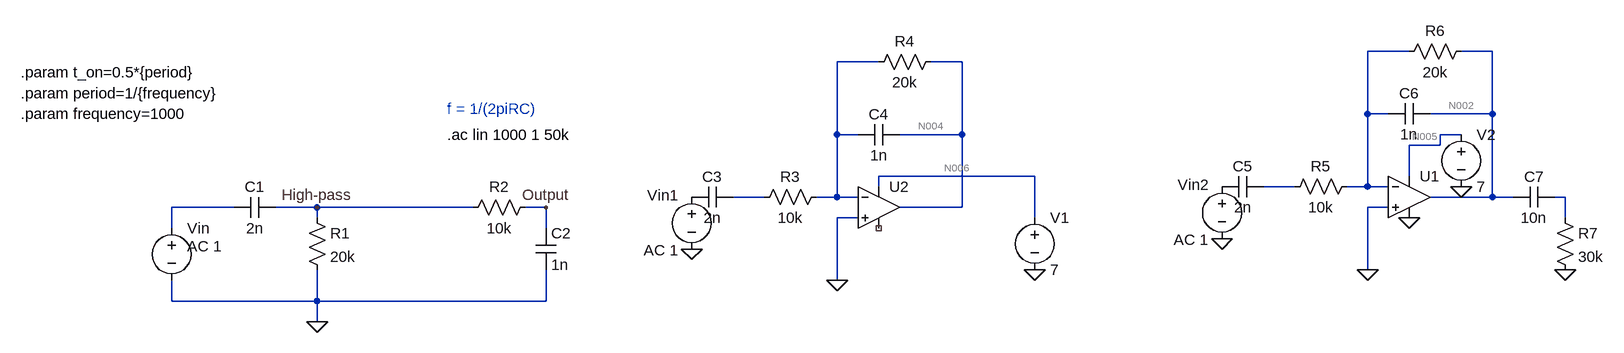
[diagram p0: schematic IR Bandpass Filters.asc]
IR Bandpass Filters.asc, the LTspice schematic file:
Version 4
SHEET 1 2036 680
WIRE 1728 -128 1664 -128
WIRE 1856 -128 1808 -128
WIRE 912 -112 848 -112
WIRE 1040 -112 992 -112
WIRE 1664 -32 1664 -128
WIRE 1696 -32 1664 -32
WIRE 1856 -32 1856 -128
WIRE 1856 -32 1760 -32
WIRE 848 0 848 -112
WIRE 880 0 848 0
WIRE 1040 0 1040 -112
WIRE 1040 0 944 0
WIRE 1808 0 1776 0
WIRE 1776 16 1776 0
WIRE 1776 16 1728 16
WIRE 1152 64 912 64
WIRE 1728 64 1728 16
WIRE 912 80 912 64
WIRE 1552 80 1504 80
WIRE 1664 80 1664 -32
WIRE 1664 80 1632 80
WIRE 1696 80 1664 80
WIRE 736 96 688 96
WIRE 848 96 848 0
WIRE 848 96 816 96
WIRE 880 96 848 96
WIRE 1856 96 1856 -32
WIRE 1856 96 1760 96
WIRE 1888 96 1856 96
WIRE 1968 96 1952 96
WIRE -80 112 -176 112
WIRE 48 112 -16 112
WIRE 288 112 48 112
WIRE 400 112 368 112
WIRE 1040 112 1040 0
WIRE 1040 112 944 112
WIRE 1696 112 1664 112
WIRE 48 128 48 112
WIRE 880 128 848 128
WIRE 1152 128 1152 64
WIRE 1968 128 1968 96
WIRE -176 144 -176 112
WIRE 400 144 400 112
WIRE 1664 208 1664 112
WIRE 848 224 848 128
WIRE -176 256 -176 224
WIRE 48 256 48 208
WIRE 48 256 -176 256
WIRE 400 256 400 208
WIRE 400 256 48 256
WIRE 48 288 48 256
FLAG 48 288 0
FLAG 48 112 High-pass
FLAG 400 112 Output
FLAG 848 224 0
FLAG 1152 208 0
FLAG 624 176 0
FLAG 1664 208 0
FLAG 1440 160 0
FLAG 1808 80 0
FLAG 1968 208 0
FLAG 1728 128 0
SYMBOL res 32 112 R0
SYMATTR InstName R1
SYMATTR Value 20k
SYMBOL cap -16 96 R90
WINDOW 0 0 32 VBottom 2
WINDOW 3 32 32 VTop 2
SYMATTR InstName C1
SYMATTR Value 2n
SYMBOL res 384 96 R90
WINDOW 0 0 56 VBottom 2
WINDOW 3 32 56 VTop 2
SYMATTR InstName R2
SYMATTR Value 10k
SYMBOL cap 384 144 R0
SYMATTR InstName C2
SYMATTR Value 1n
SYMBOL voltage -176 128 R0
WINDOW 123 24 44 Left 2
WINDOW 39 0 0 Left 0
SYMATTR Value2 AC 1
SYMATTR InstName Vin
SYMATTR Value ""
SYMBOL cap 688 80 R90
WINDOW 0 0 32 VBottom 2
WINDOW 3 32 32 VTop 2
SYMATTR InstName C3
SYMATTR Value 2n
SYMBOL res 832 80 R90
WINDOW 0 0 56 VBottom 2
WINDOW 3 32 56 VTop 2
SYMATTR InstName R3
SYMATTR Value 10k
SYMBOL OpAmps\\UniversalOpAmp 912 112 R0
SYMATTR InstName U2
SYMBOL cap 944 -16 R90
WINDOW 0 0 32 VBottom 2
WINDOW 3 32 32 VTop 2
SYMATTR InstName C4
SYMATTR Value 1n
SYMBOL res 1008 -128 R90
WINDOW 0 0 56 VBottom 2
WINDOW 3 32 56 VTop 2
SYMATTR InstName R4
SYMATTR Value 20k
SYMBOL voltage 1152 112 R0
WINDOW 123 0 0 Left 0
WINDOW 39 0 0 Left 0
SYMATTR InstName V1
SYMATTR Value 7
SYMBOL voltage 624 80 R0
WINDOW 123 -74 98 Left 2
WINDOW 39 0 0 Left 0
WINDOW 0 -68 13 Left 2
SYMATTR Value2 AC 1
SYMATTR InstName Vin1
SYMATTR Value ""
SYMBOL cap 1504 64 R90
WINDOW 0 0 32 VBottom 2
WINDOW 3 32 32 VTop 2
SYMATTR InstName C5
SYMATTR Value 2n
SYMBOL res 1648 64 R90
WINDOW 0 0 56 VBottom 2
WINDOW 3 32 56 VTop 2
SYMATTR InstName R5
SYMATTR Value 10k
SYMBOL OpAmps\\UniversalOpAmp 1728 96 R0
SYMATTR InstName U1
SYMBOL cap 1760 -48 R90
WINDOW 0 0 32 VBottom 2
WINDOW 3 32 32 VTop 2
SYMATTR InstName C6
SYMATTR Value 1n
SYMBOL res 1824 -144 R90
WINDOW 0 0 56 VBottom 2
WINDOW 3 32 56 VTop 2
SYMATTR InstName R6
SYMATTR Value 20k
SYMBOL voltage 1808 -16 R0
WINDOW 123 0 0 Left 0
WINDOW 39 0 0 Left 0
SYMATTR InstName V2
SYMATTR Value 7
SYMBOL voltage 1440 64 R0
WINDOW 123 -74 98 Left 2
WINDOW 39 0 0 Left 0
WINDOW 0 -68 13 Left 2
SYMATTR Value2 AC 1
SYMATTR InstName Vin2
SYMATTR Value ""
SYMBOL cap 1952 80 R90
WINDOW 0 0 32 VBottom 2
WINDOW 3 32 32 VTop 2
SYMATTR InstName C7
SYMATTR Value 10n
SYMBOL res 1952 112 R0
SYMATTR InstName R7
SYMATTR Value 30k
TEXT 248 -40 Left 2 ;f = 1/(2piRC)
TEXT 248 0 Left 2 !.ac lin 1000 1 50k
TEXT -408 -96 Left 2 !.param t_on=0.5*{period}
TEXT -408 -64 Left 2 !.param period=1/{frequency}
TEXT -408 -32 Left 2 !.param frequency=1000

The netlist it stands for:
* IR Bandpass Filters.asc
R1 High-pass 0 20k
C1 High-pass N010 2n
R2 Output High-pass 10k
C2 Output 0 1n
Vin N010 0 AC 1
C3 N008 P001 2n
R3 N003 N008 10k
XU2 0 N003 N006 NC_01 N004 level1 Avol=1Meg GBW=10Meg Vos=0 En=0 Enk=0 In=0 Ink=0 Rin=500Meg  ; pins In+ In- V+ V- OUT
C4 N004 N003 1n
R4 N004 N003 20k
V1 N006 0 7
Vin1 P001 0 AC 1
C5 N007 P002 2n
R5 N001 N007 10k
XU1 0 N001 N005 0 N002 level1 Avol=1Meg GBW=10Meg Vos=0 En=0 Enk=0 In=0 Ink=0 Rin=500Meg  ; pins In+ In- V+ V- OUT
C6 N002 N001 1n
R6 N002 N001 20k
V2 N005 0 7
Vin2 P002 0 AC 1
C7 N009 N002 10n
R7 N009 0 30k
* f = 1/(2piRC)
.ac lin 1000 1 50k
.param t_on=0.5*{period}
.param period=1/{frequency}
.param frequency=1000
.lib UniversalOpAmp1.lib
.backanno
.end

* Results of the author's LTspice run, read from the files saved beside the schematic
* Operating Point, zero values left out:
*   V(n004) = -140 µV
*   V(n006) = 7 V
*   V(n002) = -140 µV
*   V(n005) = 7 V
*   I(R6) = -7 nA
*   I(R4) = -7 nA
*   I(V2) = -14 nA
*   I(V1) = -14 nA
*   Ix(u2:1) = -7 nA
*   Ix(u2:2) = -7 nA
*   Ix(u2:3) = 14 nA
*   Ix(u2:5) = 6.472 nA
*   Ix(u1:1) = -7 nA
*   Ix(u1:2) = -7 nA
*   Ix(u1:3) = 14 nA
*   Ix(u1:5) = 6.472 nA